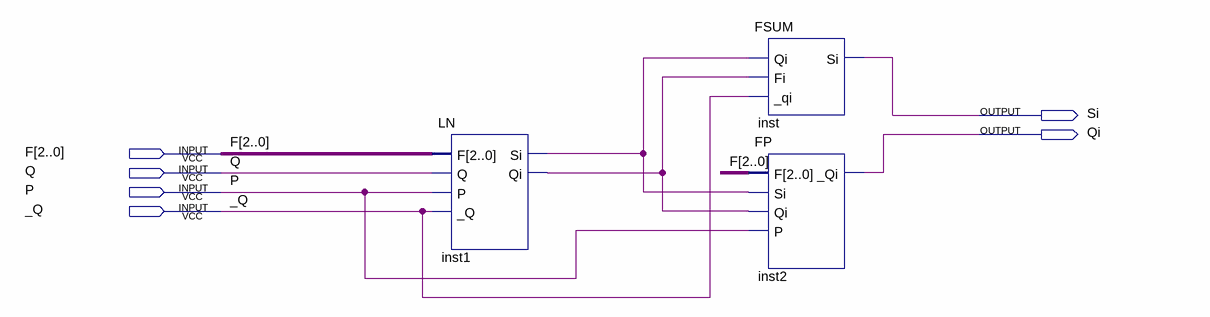
[diagram p0: schematic sheet]
// Quartus schematic LSMi.bdf as structural Verilog: 3 symbols, 6 pins
module LSMi (
  input  [2:0] F,
  input  Q,
  input  P,
  input  _Q,
  output Si,
  output Qi
);

  wire inst1_qi, inst1_si;

  LN inst1 (.F(F), .Q(Q), .P(P), ._Q(_Q), .Si(inst1_si), .Qi(inst1_qi));
  FSUM inst (.Qi(inst1_si), .Fi(inst1_qi), ._qi(_Q), .Si(Si));
  FP inst2 (.F(F), .Si(inst1_si), .Qi(inst1_qi), .P(P), ._Qi(Qi));
endmodule
